# Altium schematic sheet CX1086_Sheet1.SchDoc
size A4
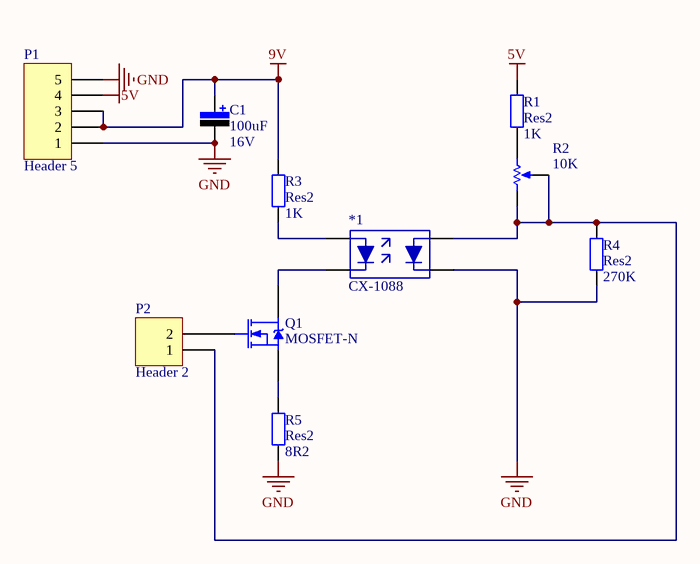
[diagram p0: CX1086_Sheet1.SchDoc]

## Parts
*1  CX-1088  [CX-1088]
C1  value 100uF  Vol: 16V  [C-RB-8]  (hidden comment: Cap Pol)
P1  Header 5  [HDR1X5]
P2  Header 2  [HDR1X2]
Q1  MOSFET-N  [TO-220AB]
R1  Res2  value 1K  [AXIAL-0.4]
R2  value 10K  [VR_A1]  (hidden comment: RES-RPot)
R3  Res2  value 1K  [AXIAL-0.4]
R4  Res2  value 270K  [AXIAL-0.4]
R5  Res2  value 8R2  [AXIAL-0.4]

## Nets
5V: P1.4 R1.2
9V: C1.1 P1.2 P1.3 R3.2
GND: *1.2(PD-K) C1.2 P1.1 P1.5 R4.1 R5.1
Net*1_1: *1.1(PD-A) P2.1 R2.1(TOP) R2.2(TAP) R4.2
Net*1_3: *1.3(IRED-A) R3.1
Net*1_4: *1.4(IRED-K) Q1.D
NetP2_2: P2.2 Q1.G
NetQ1_S: Q1.S R5.2
NetR1_1: R1.1 R2.3(BOT)

## Library data of the parts
C1 = Cap Pol: 极性电解电容; Published: 8-Jun-2000; LatestRevisionDate: 17-Jul-2002; LatestRevisionNote: Re-released for DXP Platform.; PackageReference: RB7.6-15; Publisher: Altium Limited
P1 = Header 5: Header, 5-Pin; LatestRevisionDate: 17-Jul-2002; LatestRevisionNote: Re-released for DXP Platform.; Publisher: Altium Limited
P2 = Header 2: Header, 2-Pin; LatestRevisionDate: 17-Jul-2002; LatestRevisionNote: Re-released for DXP Platform.; Publisher: Altium Limited
Q1 = MOSFET-N: N-Channel MOSFET; PackageDocument: 1995/1996; Published: 8-Jun-2000; LatestRevisionDate: 17-Jul-2002; LatestRevisionNote: Re-released for DXP Platform.; PackageReference: E3; Publisher: Altium Limited
R1 R3-R5 = Res2: Resistor; Published: 8-Jun-2000; LatestRevisionDate: 17-Jul-2002; LatestRevisionNote: Re-released for DXP Platform.; PackageReference: AXIAL-0.4; Publisher: Altium Limited; PackageDescription: Axial Device, Thru-Hole; 2 Leads; 0.4 in Pin Spacing
R2 = RES-RPot: 精密可调电阻; Sim Note: Enter the Resistance value and the set point into parameter fields.; Set Position: 0.5; Published: 8-Jun-2000; LatestRevisionDate: 17-Jul-2002; LatestRevisionNote: Re-released for DXP Platform.; PackageReference: VR5; Publisher: Altium Limited